# EAGLE schematic BP_demo_v5 (EAGLE 5.11)
OPT1: I2C; OPT2: SPI; OPT3: UART; OPT4: ____; PROJECT: Bus Pirate Demo Board v5
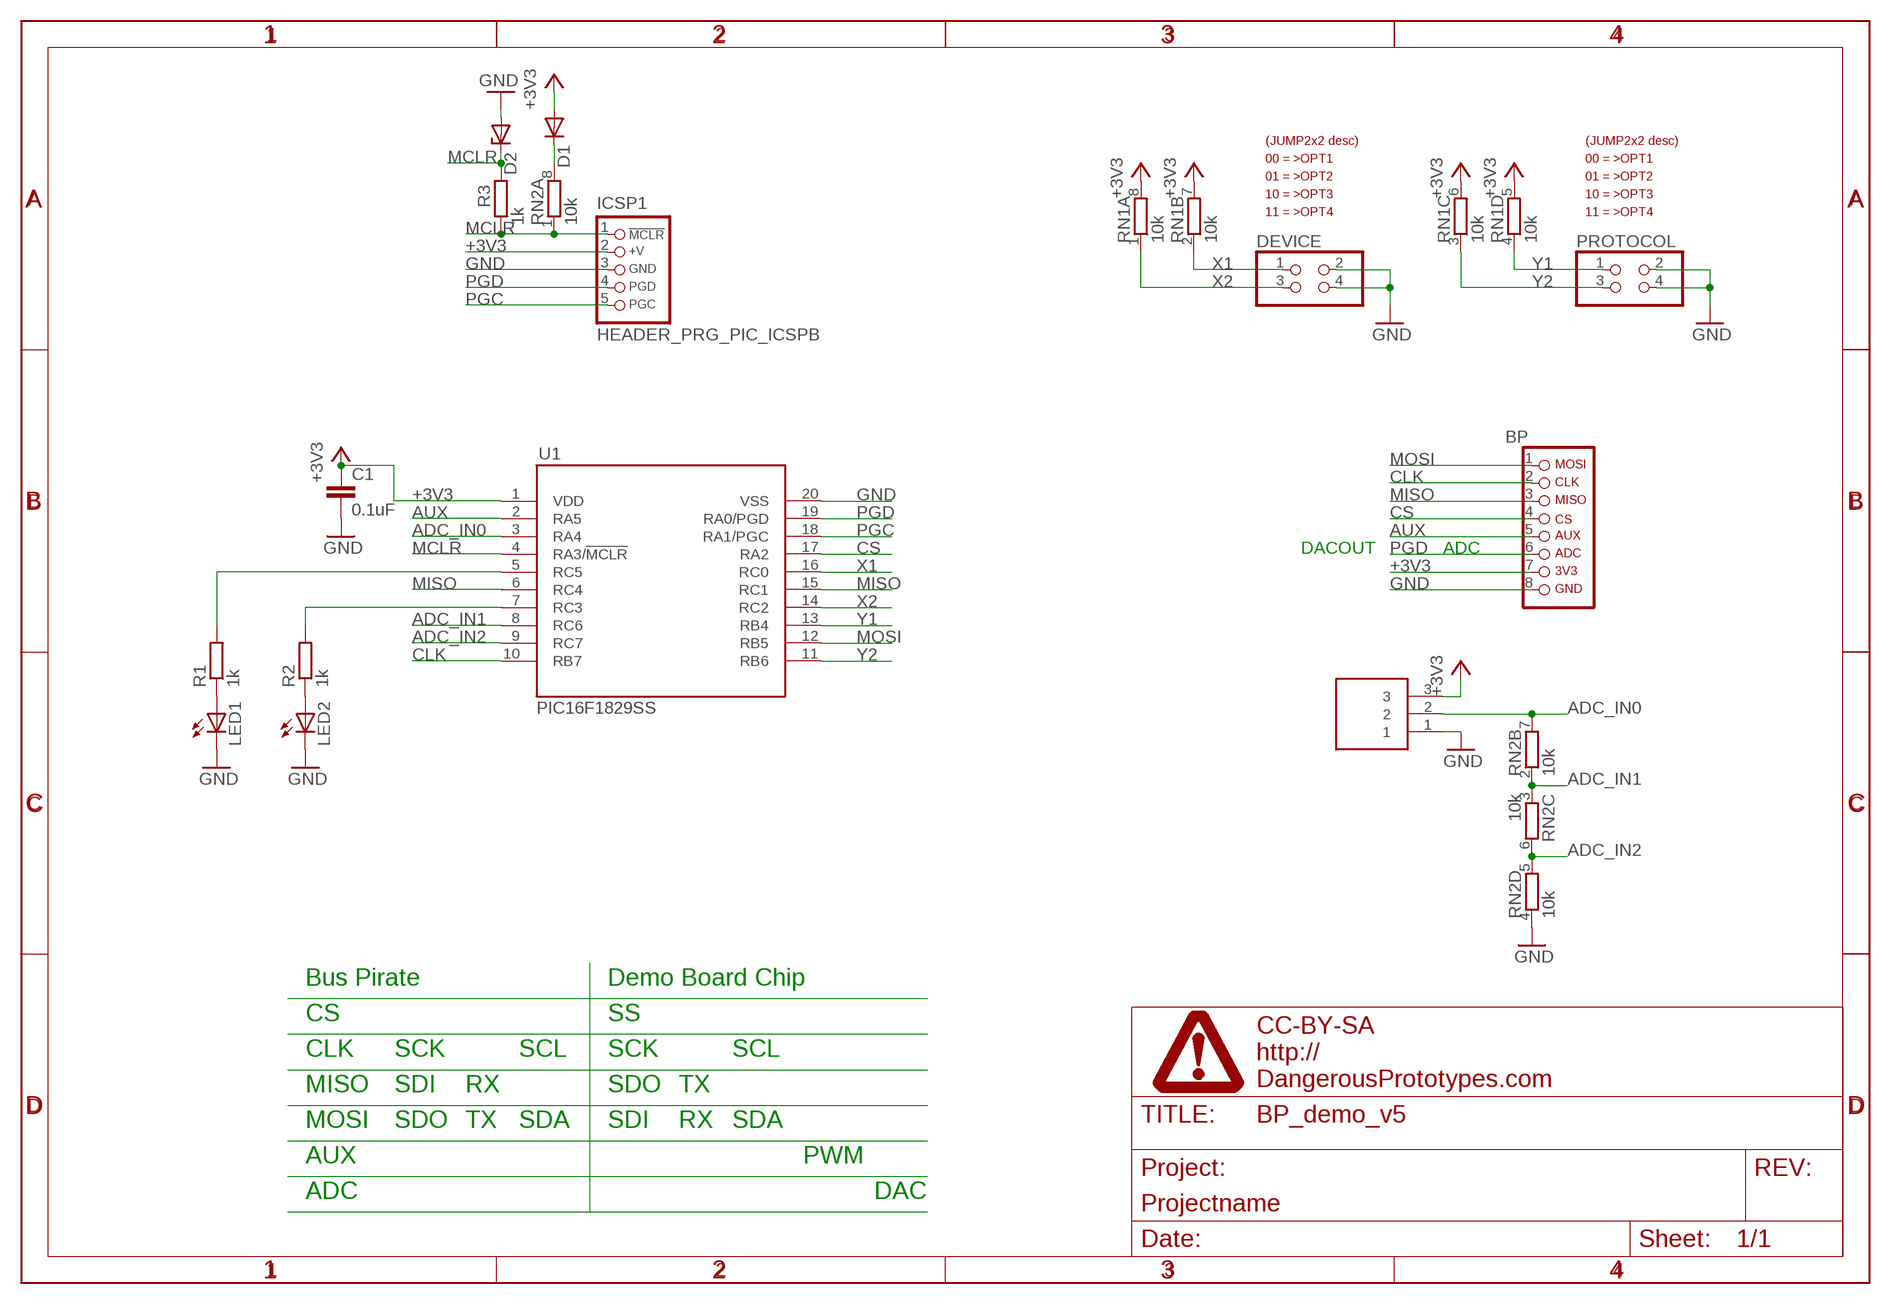
[diagram p0: schematic, sheet 1]

## Parts
ANALOG  HEADER1X3PTH  [M1X3]
BP  HDR-BUSPIRATE  [HDR-BUSPIRATE]
C1  0.1uF  CAPC603  [C603]
D1  DIODEDO323  [DO323]
D2  ZENERSOD-323F  [SOD-323F]
DEVICE  PINHD-2X2  [2X02]
ICSP1  HEADER_PRG_PIC_ICSPB  [HEADER_PRG_1X05_ICSP_B]
LED1  LED805  [LED-805]
LED2  LED805  [LED-805]
PROTOCOL  PINHD-2X2  [2X02]
R1  1k  RESISTORR603  [R603]
R2  1k  RESISTORR603  [R603]
R3  1k  RESISTORR603  [R603]
RN1  10k  RNETWORK  [RN8P-4R-CRA06S]
RN2  10k  RNETWORK  [RN8P-4R-CRA06S]
U1  PIC16F1829SS  [SSOP20]
U$2  DINA4_L  [DP_LOGO]
U$3  JUMP2X2_DESC  [JUMP2X2_DESC]
U$4  JUMP2X2_DESC  [JUMP2X2_DESC]

## Nets
+3V3: ANALOG.3 BP.7 C1.1 D1.A ICSP1.2(+V) RN1.5 RN1.6 RN1.7 RN1.8 U1.1(VDD)
ADC_IN0: ANALOG.2 RN2.7 U1.3(RA4)
ADC_IN1: RN2.2 RN2.3 U1.8(RC6)
ADC_IN2: RN2.5 RN2.6 U1.9(RC7)
AUX: BP.5 U1.2(RA5)
CLK: BP.2 U1.10(RB7)
CS: BP.4 U1.17(RA2)
GND: ANALOG.1 BP.8 C1.2 D2.A DEVICE.2 DEVICE.4 ICSP1.3(GND) LED1.C LED2.C PROTOCOL.2 PROTOCOL.4 RN2.4 U1.20(VSS)
MCLR: D2.C ICSP1.1(/MCLR) R3.1 R3.2 RN2.1 U1.4(RA3/!MCLR)
MISO: BP.3 U1.6(RC4) U1.15(RC1)
MOSI: BP.1 U1.12(RB5)
N$1: R1.2 U1.5(RC5)
N$2: LED1.A R1.1
N$7: LED2.A R2.1
N$10: R2.2 U1.7(RC3)
N$11: D1.C RN2.8
PGC: ICSP1.5(PGC) U1.18(RA1/PGC)
PGD: BP.6 ICSP1.4(PGD) U1.19(RA0/PGD)
X1: DEVICE.1 RN1.2 U1.16(RC0)
X2: DEVICE.3 RN1.1 U1.14(RC2)
Y1: PROTOCOL.1 RN1.4 U1.13(RB4)
Y2: PROTOCOL.3 RN1.3 U1.11(RB6)

## Notes on the sheet
- DACOUT | ADC
- Bus Pirate | Demo Board Chip
- CS | SS
- CLK | SCK | SCL | SCK | SCL
- MISO | SDI | RX | SDO | TX
- MOSI | SDO | TX | SDA | SDI | RX | SDA
- AUX | PWM
- ADC | DAC

## Library data of the parts
ANALOG = dp_devices:HEADER1X3
BP = dp_devices:HDR-BUSPIRATE: PIN HEADER
C1 = dp_devices:CAP
D1 = dp_devices:DIODE
D2 = dp_devices:ZENER: Zener Diode SOD-323
DEVICE PROTOCOL = pinhead:PINHD-2X2: PIN HEADER
ICSP1 = dp_devices:HEADER_PRG_PIC_ICSP: 5-pin PIC In Circuit Serial Programming header
LED1 LED2 = dp_devices:LED
R1-R3 = dp_devices:RESISTOR
RN1 RN2 = dp_devices:RNETWORK: 4 Resistor Array 0603
U1 = dp_devices:PIC16F1829
U$2 = DP2:DINA4_L: A4 DP frame Standard Dangerous Prototypes schematic frame. Automagically adds the DP logo and standard texts to the PCB Use the atrribute in the schematic editor to change the fields.; FF1: fulfillment by; FF2: Seeed Studio; FF3: www.seeedstudio.com; LICENSE: CC-BY-SA; PROJECT: Projectname; URL1: http://; URL2: DangerousPrototypes.com
U$3 U$4 = DP2:JUMP2X2_DESC; OPT1: option1; OPT2: option2; OPT3: option3; OPT4: option4